# EAGLE design MaTouch Devkit_AC Dimmer V1.2 (EAGLE 6.1)
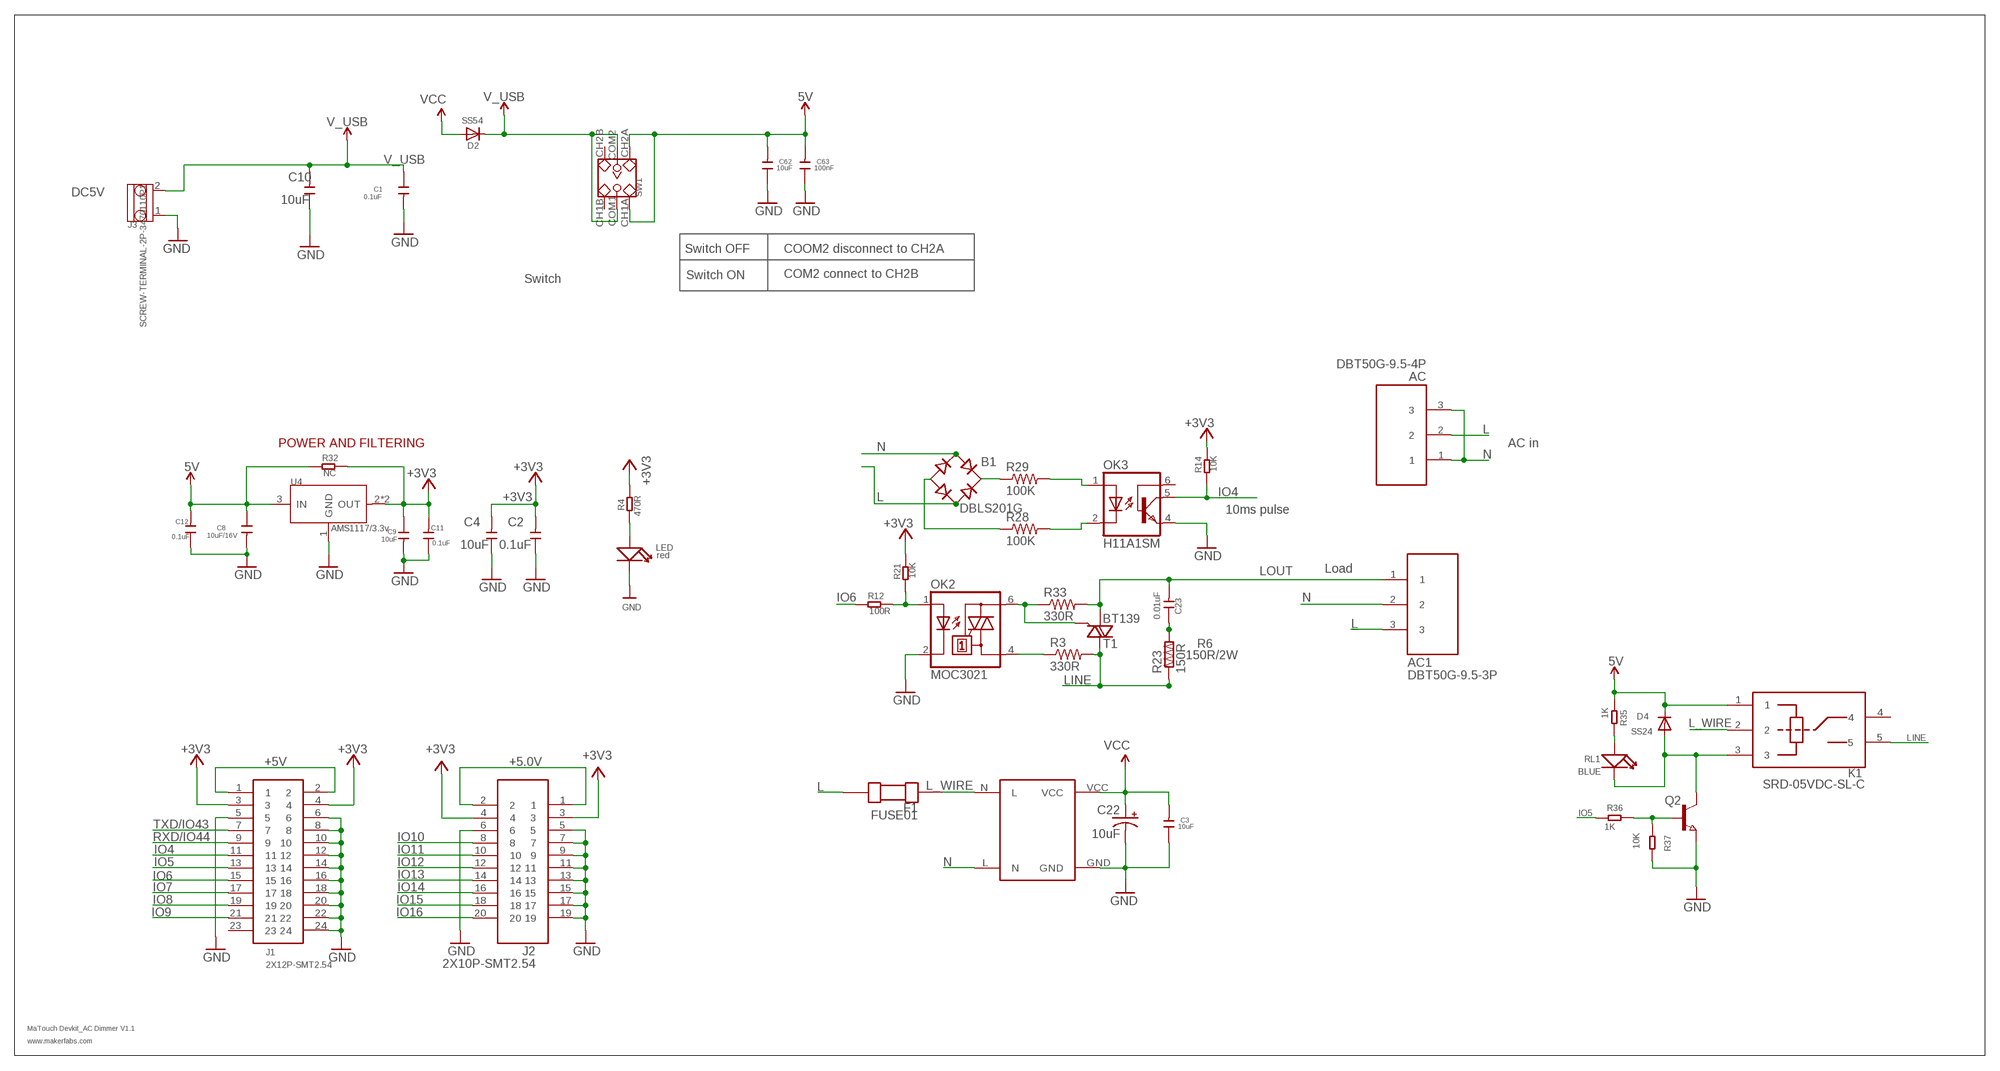
[diagram p0: schematic, sheet 1]

## Parts
AC  DBT50G-9.5-4P  DBT50G-9.5-3P  [THROUGH-HOLE-9.5]
AC1  DBT50G-9.5-3P  [THROUGH-HOLE-9.5]
B1  DBLS201G  [DBS]
C1  0.1uF  C-0603  [0603]
C2  0.1uF  C-0603  [0603]
C3  10uF  C-0603  [0603]
C4  10uF  C-0603  [0603]
C8  10uF/16V  C-0603  [0603]
C9  10uF  C-0603  [0603]
C10  10uF  C-0603  [0603]
C11  0.1uF  C-0603  [0603]
C12  0.1uF  C-0603  [0603]
C22  10uF  CAP_POL3528-KIT  [EIA3528-KIT]
C23  0.01uF  DISCRETE_C-0512  [DISCRETE_C0512/10.18]
C62  10uF  C-0603  [0603]
C63  100nF  C-0603  [0603]
D2  SS54  DIODESMA  [SMADIODE]
D4  SS24  DIODESMA  [SMADIODE]
F1  FUSE01  [FUSE01]
J1  2X12P-SMT2.54  [2X12P-SMT2.54]
J2  2X10P-SMT2.54  [2X10P-SMT2.54]
J3  SCREW-TERMINAL-2P-3470110P1  [2P-5.0]
K1  JQC3FF  [DIP5_JQC3FF]
LED  red  DISCRETE_LED0603  [DISCRETE_LED-0603]
OK2  MOC3021  MOC3031S  [DIL6-SMD]
OK3  H11A1SM  [DIL6-SMD]
Q2  NPN-TRANSISTOR_SOT23  [SOT23]
R3  330R  RESISTOR1206  [1206]
R4  470R  R-0603  [R0603]
R6  150R/2W  R-0617  [R-0617]
R12  100R  R-0603  [R0603]
R14  10K  R-0603  [R0603]
R21  10K  R-0603  [R0603]
R23  150R  R-US_V234/12  [V234/12]
R28  100K  RESISTOR1206  [1206]
R29  100K  RESISTOR1206  [1206]
R32  NC  R-0603  [R0603]
R33  330R  RESISTOR1206  [1206]
R35  1K  R-0603  [R0603]
R36  1K  R-0603  [R0603]
R37  10K  R-0603  [R0603]
RL1  BLUE  LED'0603'  [LED-0603]
SW1  SWITCH-2CH-6P'90D'  [6P-2CH-2.54-9.0X3.6-90D]
T1  BT139  BT136  [TO220AB]
U4  AMS1117/3.3v  LD1117'SOT89'  [SOT89]
U5  AC-DCHLK01  [HLK-PM01]

## Nets
5V: C8.1 C12.2 C62.2 C63.2 D4.C K1.1 R32.1 R35.1 SW1.CH1A SW1.CH2A U4.3(IN)
+3V3: C2.2 C4.2 C9.1 C11.2 J1.3 J1.4 J2.3 J2.4 R4.2 R14.2 R21.2 R32.2 U4.2(OUT) U4.4(OUT)
+5.0V: J2.1 J2.2
+5V: J1.1 J1.2
GND: C1.2 C2.1 C3.1 C4.1 C8.2 C9.2 C10.1 C11.1 C12.1 C22.C(-) C62.1 C63.1 J1.5 J1.6 J1.8 J1.10 J1.12 J1.14 J1.16 J1.18 J1.20 J1.22 J1.24 J2.5 J2.6 J2.7 J2.9 J2.11 J2.13 J2.15 J2.17 J2.19 J3.1 LED.- OK2.2(C) OK3.4(EMI) Q2.2(E) R37.2 U4.1(GND) U5.GND
IO4: J1.11 OK3.5(COL) R14.1
IO5: J1.13 R36.1
IO6: J1.15 R12.1
IO7: J1.17
IO8: J1.19
IO9: J1.21
IO10: J2.8
IO11: J2.10
IO12: J2.12
IO13: J2.14
IO14: J2.16
IO15: J2.18
IO16: J2.20
L: AC1.3 AC.2 B1.AC2 F1.P$2
L_WIRE: F1.P$1 K1.2 U5.N(L)
LINE: K1.5 R3.2 R6.1 R23.1 T1.2(A2)
LOUT: AC1.1 C23.P$2 R33.2 T1.1(A1)
N: AC1.2 AC.1 AC.3 B1.AC1 U5.L(N)
N$2: C23.P$1 R6.2 R23.2
N$3: LED.+ R4.1
N$14: OK2.1(A) R12.2 R21.1
N$15: B1.- R28.1
N$16: OK2.4(A1) R3.1
N$17: B1.+ R29.1
N$18: OK3.1(A) R29.2
N$19: OK3.2(C) R28.2
N$21: OK2.6(A2) R33.1 T1.3(G)
N$26: R35.2 RL1.+
N$27: D4.A K1.3 Q2.3(C) RL1.-
N$28: Q2.1(B) R36.2 R37.1
RXD/IO44: J1.9
TXD/IO43: J1.7
V_USB: C1.1 C10.2 D2.C J3.2 SW1.COM1 SW1.COM2
VCC: C3.2 C22.A(+) D2.A U5.VCC
Unconnected: J1.23 K1.4 OK3.6(BAS) SW1.CH1B SW1.CH2B

## Notes on the sheet
- DC5V
- Switch OFF | COOM2 disconnect to CH2A
- Switch ON | COM2 connect to CH2B
- Switch
- POWER AND FILTERING | AC in
- 10ms pulse
- Load
- SRD-05VDC-SL-C
- MaTouch Devkit_AC Dimmer V1.1
- www.makerfabs.com

## Library data of the parts
AC AC1 = self:DBT50G-9.5-3P
B1 = rectifier:DB?*G: Single Phase 1.0 AMP Glass Passivated Bridge Rectifier Taiwan Semiconductor Co.,Ltd. - TSC Source: http://www.taiwansemi.com/TSCbig5/ezcatfiles/cust/img/img/db101g.pdf http://www.ts.com.tw/db/pictures/modules/PDT/PDT060207001/DBLS201G.pdf
C1-C4 C8-C12 C62 C63 = Discrete:C*: Ceramic Capacitors
C22 = SparkFun-Capacitors:CAP_POL: Capacitor Polarized These are standard SMD and PTH capacitors. Normally 10uF, 47uF, and 100uF in electrolytic and tantalum varieties. Always verify the external diameter of the through hole cap, it varies with capacity, voltage, and manufacturer. The EIA devices should be standard.
C23 = A9G:DISCRETE_C*: Ceramic Capacitors
D2 D4 = adafruit:DIODE: Diode SMADIODE - SMA Surface Mount Package 20V 1A Schottky Diode Digikey: 641-1014-6-ND DO-1N4148 - Through Hole Small Current Diode SOD-123 20V 1 A (.5mV Vf) Schottky Diode - Digikey: MBRX120TPMSCT-ND SOD-323 10V 570mA (.38mV Vf, 3ns) Schottky Diode - Digikey: ZLLS410CT-ND SOD-523 30V 30mA Schottky Diode (RB751S-40TE61) - Digikey: RB751S-40TE61CT-ND SOT23-R/W - SOT23 Package (R = Solder Paste/Reflow Ovens, W = Hand-Soldering) BAT54Film 40V 300mA - Digikey: 497-7162-1-ND
F1 = FUSE01:FUSE01: FUSE
J1 = sale:2X12P-SMT2.54
J2 = sale:2X10P-SMT2.54
J3 = OPL Eagle Library:SCREW-TERMINAL-2P
K1 = 1mytest:JQC3FF
LED = A9G:DISCRETE_LED*
OK2 = optocoupler:MOC30*: 6-Pin DIP Zero-Cross Optoisolators Triac Driver Output (250/400 Volt Peak) Source: Data sheet <http://www.fairchildsemi.com/ds/MO/MOC3031M.pdf> The old path of data sheet not more available 2013-05-06.; MF: FAIRCHILD SEMICONDUCTOR; MPN: MOC3031SM; OC_FARNELL: unknown; OC_NEWARK: 34C1335
OK3 = optocoupler:H11A*?M: General Purpose 6-Pin Phototransistor Optocouplers Source: http://www.fairchildsemi.com/ds/4N/4N35-M.pdf; OC_FARNELL: unknown; OC_NEWARK: unknown
Q2 = semicon-smd-ipc:NPN-TRANSISTOR_: NPN TRANSISTOR
R3 R28 R29 R33 = SparkFun-Resistors:RESISTOR: Resistor Basic schematic elements and footprints for 0603, 1206, and PTH resistors.; K: 45K
R4 R12 R14 R21 R32 R35-R37 = Discrete:R*
R6 = Makerfabs-Peter:R-0617
R23 = adafruit2:R-US_: RESISTOR, American symbol
RL1 = Discrete:LED*
SW1 = Discrete:SWITCH-2CH-6P
T1 = triac:BT136: Triac BT136 series E sensitive gate Source: http://www.nxp.com/acrobat_download/datasheets/BT136_SERIES_E_2.pdf
U4 = IC:LD1117: Low Drop Fixed And Adjustable Positive Voltage Regulators http://www.datasheetcatalog.org/datasheet/SGSThomsonMicroelectronics/mXuqtqv.pdf
U5 = Moja Knjižnica:AC-DCHLK01

## Net classes
0 default: width 0.203 mm

## Board
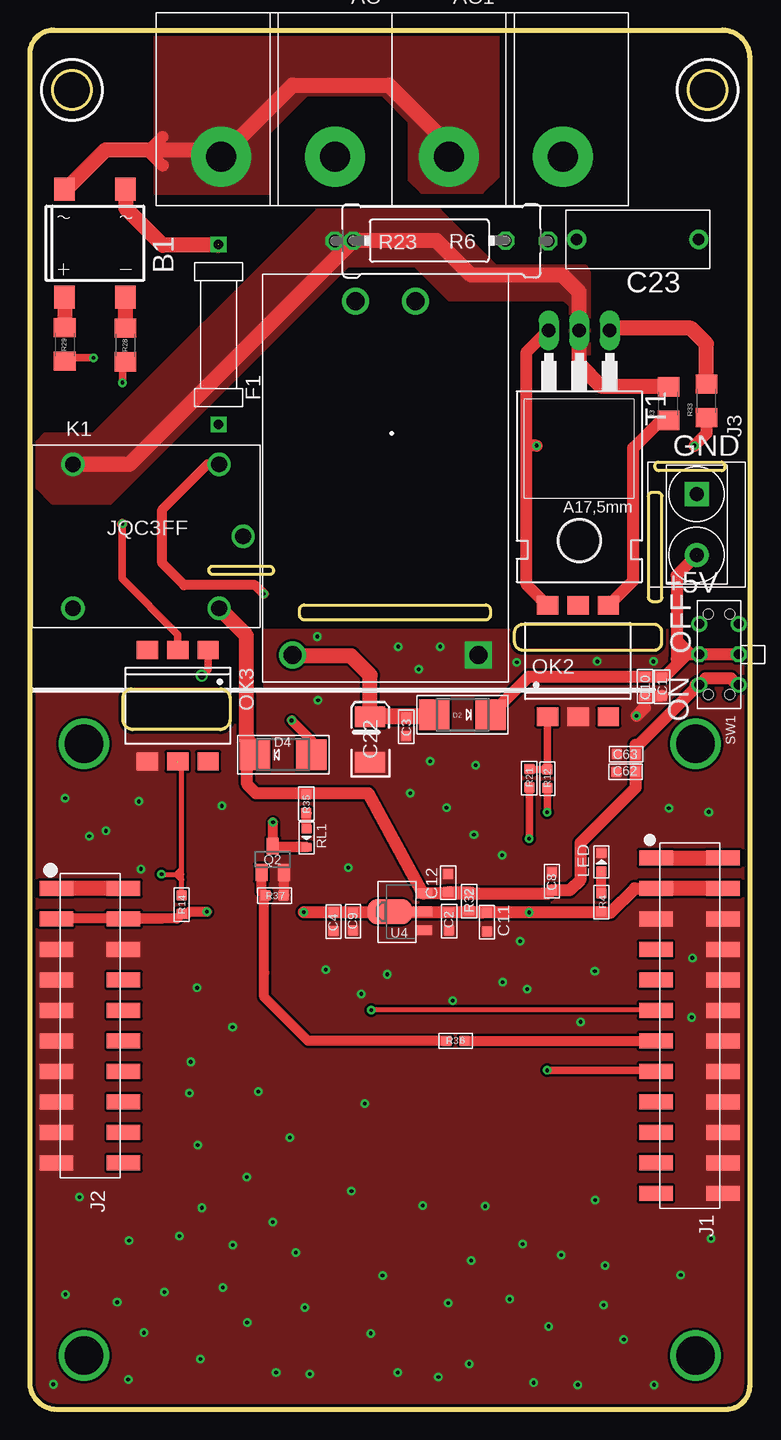
[diagram p1: board, top side]
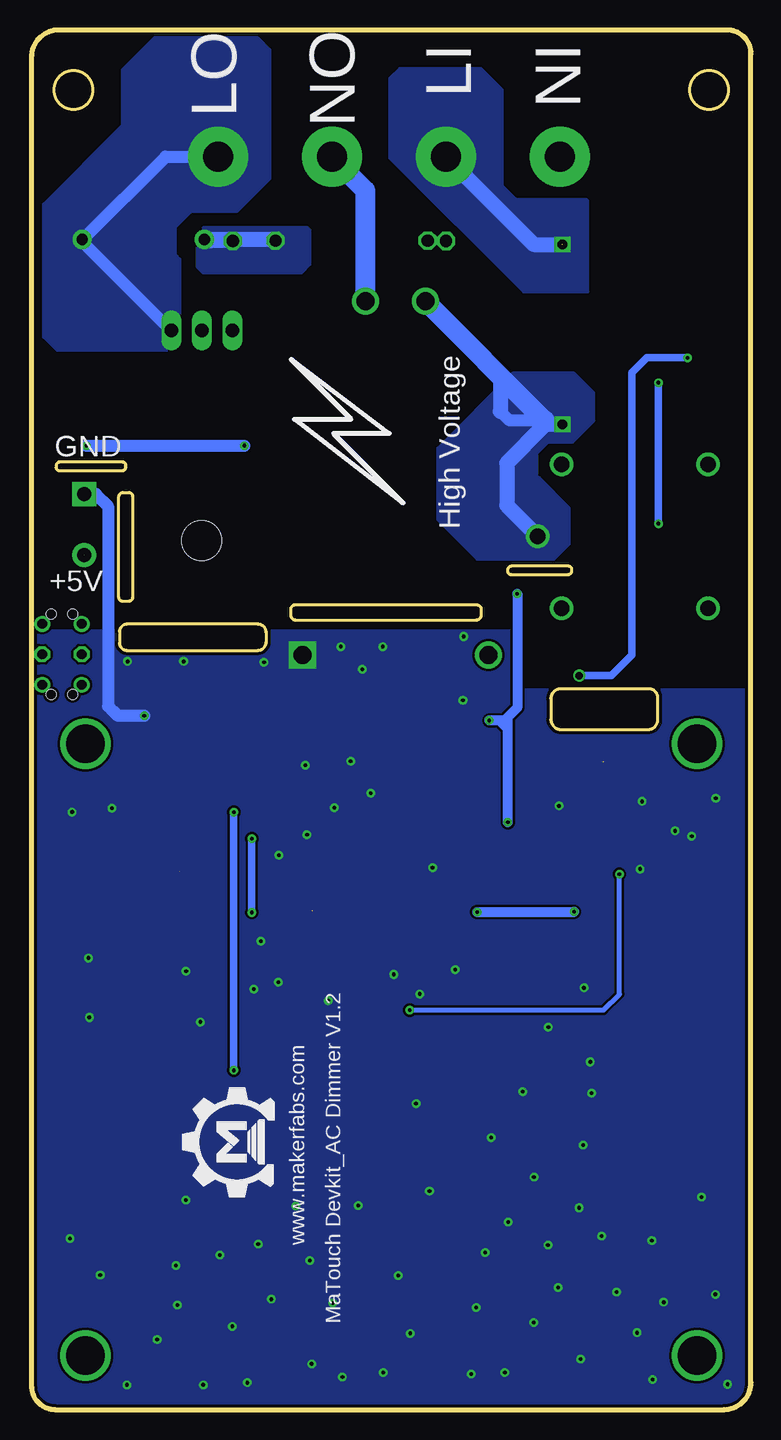
[diagram p2: board, bottom side, seen from below]

Size 60 x 115 mm. Coordinates in mm from the lower left corner, seen from the top.
Outline: 60,112.73 60,1.97 arc-90 58.03,0 2.24,0 arc-90 0,2.24 0,113.01 arc-90 1.99,115 57.73,115 arc-90 60,112.73
Outline: 52.65,64.84 52.65,63.9 arc-90 52.03,63.28 41.14,63.28 arc-90 40.41,64.01 40.41,64.75 arc-90 41.13,65.47 52.02,65.47 arc-90 52.65,64.84
Outline: 16.69,59.25 16.69,57.54 arc-90 15.82,56.68 8.6,56.68 arc-90 7.77,57.5 7.77,59.34 arc-90 8.51,60.08 15.86,60.08 arc-90 16.69,59.25
Outline: 38,65.82 22.9,65.82 arc-90 22.48,66.24 22.48,66.68 arc-90 22.87,67.07 38.01,67.07 arc-90 38.38,66.7 38.38,66.2 arc-90 38,65.82
Outline: 57.68,78.27 52.44,78.27 arc-90 52.12,78.59 52.12,78.71 arc-90 52.39,78.98 57.65,78.98 arc-90 57.94,78.69 57.94,78.53 arc-90 57.68,78.27
Outline: 52.37,76.44 51.87,76.44 arc90 51.56,76.13 51.56,67.71 arc90 51.9,67.37 52.38,67.37 arc90 52.7,67.69 52.7,76.11 arc90 52.37,76.44
Outline: 20,69.61 15.24,69.61 arc-90 14.94,69.92 14.94,70.04 arc-90 15.19,70.29 19.99,70.29 arc-90 20.3,69.99 20.3,69.9 arc-90 20,69.61
Outline: circle at 3.5,110 radius 1.6
Outline: circle at 56.5,110 radius 1.6
Copper layers (1*16): Top 0.035mm / dielectric 1.5mm / Bottom 0.035mm
Design rules: minimum track width 10mil, minimum drill 10mil, track to track 8mil, track to pad 8mil, pad to pad 8mil, via to via 8mil, smd to smd 0mil, copper to edge 10mil, drill to drill 8mil, minimum pad ring 10mil, minimum via ring 8mil, stop-mask expansion 4mil, vias tented up to drill 30mil, thermal gap 0mil

### Footprints (pad centres in the part's own frame; a part is rotated, then mirrored left to right if it is on the bottom)
THROUGH-HOLE-9.5 = drill 2.5 pad 5: 1 -9.5,0; 2 0,0; 3 9.5,0
DBS = smd 1.7 x 1.9: + -2.55,-4.5; - 2.55,-4.5; AC1 -2.55,4.5; AC2 2.55,4.5
0603 = smd 0.889 x 0.889: 1 -0.762,0; 2 0.762,0
EIA3528-KIT = smd 1.7 x 2.5: A 1.9,0; C -1.9,0
DISCRETE_C0512/10.18 = drill 0.95 pad 1.6: P$1 -5.09,0; P$2 5.09,0
SMADIODE = smd 2.54 x 2.54: A 2.349,0; C -2.349,0
FUSE01 = drill 0.8 square: P$1 -7.5,0; P$2 7.5,0
2X12P-SMT2.54 = smd 1.27 x 2.8: 1 -13.97,-2.8; 2 -13.97,2.8; 3 -11.43,-2.8; 4 -11.43,2.8; 5 -8.89,-2.8; 6 -8.89,2.8; 7 -6.35,-2.8; 8 -6.35,2.8; 9 -3.81,-2.8; 10 -3.81,2.8; 11 -1.27,-2.8; 12 -1.27,2.8; 13 1.27,-2.8; 14 1.27,2.8; 15 3.81,-2.8; 16 3.81,2.8; 17 6.35,-2.8; 18 6.35,2.8; 19 8.89,-2.8; 20 8.89,2.8; 21 11.43,-2.8; 22 11.43,2.8; 23 13.97,-2.8; 24 13.97,2.8
2X10P-SMT2.54 = smd 1.27 x 2.8: 1 -11.43,-2.8; 2 -11.43,2.8; 3 -8.89,-2.8; 4 -8.89,2.8; 5 -6.35,-2.8; 6 -6.35,2.8; 7 -3.81,-2.8; 8 -3.81,2.8; 9 -1.27,-2.8; 10 -1.27,2.8; 11 1.27,-2.8; 12 1.27,2.8; 13 3.81,-2.8; 14 3.81,2.8; 15 6.35,-2.8; 16 6.35,2.8; 17 8.89,-2.8; 18 8.89,2.8; 19 11.43,-2.8; 20 11.43,2.8
2P-5.0 = drill 1.168 pad 2.032 square: 1 -2.54,0 | drill 1.168 pad 2.032: 2 2.54,0
DIP5_JQC3FF = drill 1.3: 1 0,12; 2 -2,6; 3 0,0; 4 12.2,12; 5 12.2,0
DISCRETE_LED-0603 = smd 0.889 x 0.889: + -0.762,0; - 0.762,0
DIL6-SMD = smd 1.78 x 1.52: 1 -2.54,-4.645; 2 0,-4.645; 3 2.54,-4.645; 4 2.54,4.645; 5 0,4.645; 6 -2.54,4.645
SOT23 = smd 1 x 1.4: 1 -0.95,-1.1; 2 0.95,-1.1; 3 0,1.1
1206 = smd 1.6 x 1.8: 1 -1.4,0; 2 1.4,0
R0603 = smd 0.889 x 0.889: 1 -0.762,0; 2 0.762,0
R-0617 = drill 1.016 octagon: 1 -8.89,0; 2 8.89,0
V234/12 = drill 1.016 octagon: 1 -6.35,0; 2 6.35,0
LED-0603 = smd 0.762 x 0.889: + -0.762,0; - 0.762,0
6P-2CH-2.54-9.0X3.6-90D = drill 0.813 pad 1.27: CH1A -2.54,-1.65; CH1B 2.54,-1.65; CH2A -2.54,1.65; CH2B 2.54,1.65 | drill 0.813 pad 1.27 octagon: COM1 0,-1.65; COM2 0,1.65 | hole 0.813: -3.35,0.9; -3.35,-0.9; 3.35,0.9; 3.35,-0.9
TO220AB = drill 1.118 long: 1 -2.54,-6.35; 2 0,-6.35; 3 2.54,-6.35 | hole 3.302: 0,11.176
SOT89 = smd 0.8 x 1.4: 1 -1.524,-1.905; 3 1.524,-1.905 | smd 0.8 x 1.9: 2 0,-1.651 | smd 2.032 x 3.65: 4 0,0.94
HLK-PM01 = drill 1.5 square: GND 14.75,7.75 | drill 1.5: L -14.75,2.5; N -14.75,-2.5; VCC 14.75,-7.75

### Placement (x,y rotation side)
AC  25.45,104.46 180 top
AC1  34.95,104.46 180 top
B1  5.41,97.22 0 top
C1  52.7,60.26 270 top
C2  34.95,40.72 90 top
C3  31.37,56.91 90 top
C4  25.32,40.67 90 top
C8  43.52,44.06 90 top
C9  26.93,40.7 270 top
C10  51.28,60.29 90 top
C11  38.1,40.63 90 top
C12  34.87,43.9 270 top
C22  28.37,55.87 90 top
C23  50.67,97.55 0 top
C62  49.67,53.16 0 top
C63  49.69,54.63 0 top
D2  36.07,57.92 180 top
D4  21.11,54.6 0 top
F1  15.72,89.62 90 top
J1  55,32 270 top
J2  5,32 270 top
J3  55.6,73.77 270 top
K1  15.77,78.8 180 top
LED  47.65,45.63 90 top
OK2  45.69,62.39 0 top
OK3  12.32,58.66 180 top
Q2  20.24,45.86 0 top
R3  53.24,83.86 90 top
R4  47.65,42.28 270 top
R6  34.32,97.42 0 top
R12  43.15,52.59 90 top
R14  12.65,42.07 270 top
R21  41.63,52.61 270 top
R23  33.3,97.45 0 top
R28  7.95,88.73 270 top
R29  2.9,88.78 270 top
R32  36.62,42.38 270 top
R33  56.41,84.09 90 top
R35  23.04,50.51 270 top
R36  35.48,30.74 180 top
R37  20.4,42.84 0 top
RL1  23.06,47.64 270 top
SW1  57.45,62.95 90 top
T1  45.8,83.6 180 top
U4  30.94,41.5 90 top
U5  29.64,77.63 270 top
U$2  [MAKERFABS_0.3]  39.79,18.18 90 bottom

### Tracks (layer width: path | path; a pad name or v marks a point on that pad's centre or on a via)
5V
  Top 0.406: U4.3 32.65,43.22 | R32.1
  Top 0.813: U4.3 32.86,43.02 32.87,43.01 33.45,43.01 33.48,43.04 | C62.2 50.44,54.62 C63.2 50.46,54.65 50.49,54.65 | R35.1 22.94,51.37
  Top 1.016: 55.73,60.41 SW1.CH2A 56.34,60.95 58.45,60.95 58.98,60.41 SW1.CH1A | 55.73,60.41 55.5,60.41 | 34.77,43.04 43.26,43.04 C8.1 45.01,43.3 45.92,44.21 45.92,47.26 50.49,51.83 50.49,54.65 50.49,55.41 50.72,55.41 55.73,60.41 | 32.65,43.22 28.23,51.37 22.94,51.37 18.85,51.37 18.11,52.11 18.11,54.42 18.58,54.42 D4.C | 34.77,43.04 C12.2 R32.1 | 34.77,43.04 32.66,43.04 32.61,43.09 32.77,43.09 U4.3
  Top 1.27: D4.C 18.76,55.12 18.06,55.81 18.06,64.52 K1.1
+3V3  (via drill 0.3)  (1 unrouted)
  Top 0.406: 25.3,41.45 C4.2 26.9,41.43 C9.1 | U4.4 U4.2 34.93,41.5 C2.2 36.48,41.48 R32.2 36.85,41.38
  Top 0.61: C9.1 | 29.96,41.46 U4.4 30.03,41.46 30.3,41.46 30.34,41.43 | C11.2 37.74,41.39 37.69,41.43 | R21.2 v41.63,47.59 | v41.63,41.44 36.73,41.44 36.6,41.57
  Top 0.813: v14.76,41.49 13.28,41.49 13.08,41.29 12.68,41.29 R14.2 12.27,40.93 11,40.93 | 11,40.93 2.06,40.93 2.1,40.89 J2.3 | J2.4 7.84,40.93 11,40.93 | R4.2 47.62,41.49 47.62,41.43
  Top 1.016: v22.84,41.46 C9.1 29.96,41.46 | 30.34,41.43 37.69,41.43 47.62,41.43 47.74,41.43 48.4,41.43 50.42,43.45 52.25,43.45 | 52.25,43.45 52.32,43.45 52.35,43.42 | J1.3 52.23,43.43 52.25,43.45
  Top 1.27: J1.4 J1.3
  Bottom 0.61: v41.63,47.59 v41.63,41.44
  Bottom 0.813: v22.84,41.46 14.78,41.46 v14.76,41.49
+5.0V
  Top 1.27: J2.2 J2.1
+5V
  Top 1.27: J1.1 J1.2
GND  (via drill 0.3)
  Top 0.813: R37.2 21.19,42.87 Q2.2
  Top 1.016: v50.6,57.82 51.28,58.51 C10.1 51.31,59.5 C1.2
  Bottom 1.016: v50.6,57.82 52.81,57.82 53.09,58.1 | 53.09,58.1 53.62,58.64 53.62,75.3 54.63,76.31 J3.1 | 53.09,58.1 53.09,58.15
  other vias: 9.07,50.69 8.19,2.49 7.27,8.94 16.9,31.88 2.97,9.6 16.08,10.16 4.11,17.7 12.46,14.45 1.94,2.1 22.15,13.08 14.21,4.22 36.64,3.81 30.67,3.07 45.68,2.06 42,2.23 28.41,6.35 56.78,14.25 43.24,6.93 49.52,5.84 52.03,2.06 31.71,51.38 22.92,8.51 36.79,12.42 8.27,14.07 20.26,15.62 53.28,50.14 55.18,32.69 55.23,37.64 24.66,36.66 26.81,18.21 39.99,9.19 34.86,8.89 47.84,8.71 54.27,11.2 32.75,16.99 37.96,16.94 35.24,34.09 27.93,25.5 16.93,13.71 29.78,36.27 18.1,19.38 13.3,26.39 39.41,35.63 45.91,32.31 13.98,22.05 47.13,17.45 6.34,48.23 19.04,26.49 40.88,39.04 41.47,35.05 4.94,47.8 16.01,50.32 37.02,47.93 9.49,6.4 9.26,45.06 56.6,49.81 34.73,50.16 14.34,16.81 44.28,12.88 26.56,45.16 29.4,11.17 13.93,35.15 23.34,2.97 20.52,3.07 11.2,9.78 47.95,11.99 18.11,7.26 34.06,2.72 27.63,34.64 41.1,13.79 39.38,46.2 2.93,50.95 21.65,22.66 37.17,53.69 13.4,28.98 47.1,36.55 33.39,54.05 30.7,63.6 51.98,62.36 47.31,62.36 40.6,62.3 24.02,59.13 23.96,64.44 34.2,63.6 32.42,61.7
  pour Top: 63.02,-1.44 -2.08,-1.44 -2.08,60.08 19.58,60.08 19.58,64.98 63.02,64.98
  pour Bottom: 63.12,-1.54 -1.98,-1.54 -1.98,59.98 19.68,59.98 19.68,64.88 63.12,64.88
IO4  (via drill 0.3)  (1 unrouted)
  Top 0.406: J1.11 52.17,33.3 v28.45,33.3 | R14.1 12.65,44.16 | 12.65,44.16 12.65,44.64 | 12.65,44.64 12.65,53.66 12.32,53.99 | v10.97,44.61 12.19,44.61 | 12.19,44.61 12.62,44.61 12.65,44.64 | 12.6,45.02 12.19,44.61 | 12.19,44.61 12.65,44.16
  Bottom 0.406: v28.45,33.3 12.29,33.3 10.97,34.62 v10.97,44.61
IO5
  Top 0.813: R36.1 36.27,30.72 52.35,30.72 52.34,30.73 J1.13
IO6  (via drill 0.3)
  Top 0.61: v43.13,49.8 43.13,51.8 R12.1 | v43.13,28.27 52.15,28.27 52.25,28.18 J1.15
  Bottom 0.61: v43.13,28.27 v43.13,49.8
L  (1 unrouted)
  Top 1.27: 15.72,97.17 15.72,97.04 11.07,97.04 8,100.11 8,101.64 7.92,101.71 7.93,101.72 B1.AC2
  Bottom 1.27: AC.2 18.12,97.12 F1.P$2
  pour Bottom: 13.64,100.8 13.64,93.13 18.31,93.13 18.95,93.13 30.1,104.28 30.1,111.01 29.29,111.82 22.53,111.82 20.75,110.04 20.75,102.07 19.58,100.9 13.74,100.9
L_WIRE
  Bottom 1.016: 17.21,82.45 20.13,82.45 20.93,83.25
  Bottom 1.27: F1.P$1 16.88,82.12 17.21,82.45 17.21,82.04 20.37,78.88 20.37,75.37 17.78,72.78 K1.2 | 20.9,86.22 20.9,83.22
  Bottom 1.676: 17.21,82.45 U5.N
  pour Bottom: 17.86,77.71 17.7,77.71 15.16,75.17 15.16,72.12 16.43,70.85 22.81,70.85 26.11,74.15 26.11,80.15 19.84,86.42 14.78,86.42 13.16,84.8 13.16,82.36 14.91,80.61 16.94,80.61 17.88,79.67 17.88,77.74
LINE
  Top 1.27: R3.2 53.16,85.33 47.57,85.33 45.8,87.1 T1.2 45.8,93.15 44.4,94.55 44.32,94.55 44.3,94.58 36.78,94.58 33.91,97.45 R23.1 8.31,78.8 K1.5
  pour Top: 1.22,81.34 5.28,81.34 23.98,100.04 34.16,100.04 38.84,95.36 46.3,95.36 46.66,94.78 46.66,87.97 45.77,87.97 45.06,88.73 45.06,91.96 44.5,92.47 34.95,92.47 32.11,95.31 26.52,95.31 6.73,75.53 1.85,75.53 0.58,76.8 0.58,80.71
LOUT
  Top 1.27: R33.2 56.41,88.83 55.12,90.13 48.9,90.13 T1.1
  Bottom 1.016: 46.29,104.46 AC1.1 48.82,104.46 55.68,97.6 | T1.1 55.68,97.29 55.68,97.6 | 55.68,97.6 55.73,97.55 C23.P$2
  pour Bottom: 42.85,99.86 46.69,99.86 48.03,98.51 48.03,96.3 47.62,95.9 47.62,89.27 48.62,88.28 57.86,88.28 58.98,89.39 58.98,100.49 52.37,107.1 52.37,111.75 49.73,114.39 41.15,114.39 40.13,113.37 40.13,102.58
N
  Top 1.016: 11.02,106.08 9.86,104.91 11.07,103.69 11.1,103.69
  Top 1.27: AC.1 34.95,105.4 29.95,110.4 21.89,110.4 AC.3 15.42,104.99 6.27,104.99 2.95,101.66 2.9,101.66 2.87,101.69 B1.AC1 | B1.AC1 2.87,101.79 | B1.AC1
  Bottom 1.676: U5.L 32.14,101.62 35,104.48 34.98,104.48 AC.1
  pour Top: 10.41,101.38 19.91,101.38 19.91,106.36 23.14,109.59 29.34,109.59 31.62,107.3 31.62,102.47 32.64,101.46 37.74,101.46 39.07,102.78 39.07,114.97 10.41,114.97
N$1  (via drill 3.2)
  other vias: 4.5,4.5
N$2
  Bottom 1.27: C23.P$1 45.09,97.55 | 45.09,97.55 39.73,97.55 39.73,97.47 39.65,97.47 R23.2 | R6.2 45.09,97.42 45.09,97.55
  pour Bottom: 36.75,98.31 36.98,98.54 45.64,98.54 46.2,97.98 46.2,95.24 45.75,94.78 37.44,94.78 36.75,95.46
N$3  (1 unrouted)
  Top 0.813: R4.1 47.65,44.84 47.68,44.87
N$6A  (via drill 3.2)
  other vias: 55.5,4.5
N$7A  (via drill 3.2)
  other vias: 55.5,55.5
N$8A  (via drill 3.2)
  other vias: 4.5,55.5
N$14
  Top 0.61: OK2.1 R12.2 41.66,53.35 R21.1
N$15
  Top 1.27: R28.1 7.96,90.14 B1.-
N$16
  Top 1.016: OK2.4 50.29,69.1 50.29,80.15 52.6,82.46 R3.1
N$17
  Top 1.27: B1.+ 2.9,92.68 R29.1
N$18  (via drill 0.3, 0.6)
  Top 0.61: v5.28,87.67 3.25,87.67 3.07,87.49 3,87.49 R29.2 | v14.33,61.17 14.86,61.71 OK3.1
  Bottom 0.61: v5.28,87.67 8.69,87.67 9.93,86.42 9.93,62.88 11.63,61.17 v14.33,61.17
N$19  (via drill 0.3)
  Top 0.61: v7.72,85.6 7.72,87.11 | OK3.2 12.32,64.6 7.67,69.25 7.67,73.8
  Top 0.813: 7.67,73.8 v7.72,73.85
  Top 1.27: 7.72,87.11 R28.2
  Bottom 0.61: v7.72,73.85 v7.72,85.6
N$21  (via drill 0.3)
  Top 1.016: OK2.6 41.4,68.79 41.4,80.22 | 41.4,80.22 41.4,88.15 43.18,89.93 | R33.1 56.41,81.37 v55.4,80.35 | v42.24,80.35 41.53,80.35 41.4,80.22
  Top 1.27: T1.3 43.23,89.93 43.18,89.93
  Bottom 1.016: v55.4,80.35 v42.24,80.35
N$26
  Top 0.813: RL1.+ 23.06,49.72 R35.2
N$27  (via drill 0.3)
  Top 0.813: v21.82,57.44 23.46,55.8 D4.A 23.47,54.65 | v20.27,48.96 20.27,46.98 Q2.3 20.33,46.87 23.01,46.87 | RL1.- 23.01,46.87 | 23.01,46.87 22.99,46.9 20.32,46.9 20.3,46.92 20.27,46.92 | K1.3 14.81,78.8 11.02,75.02 11.02,70.55 12.85,68.72 18.77,68.72 v19.48,68.01
  Bottom 0.813: v19.48,68.01 19.48,58.51 20.36,57.63 | 20.36,57.63 20.55,57.44 20.78,57.44 | 20.78,57.44 20.85,57.44 | 20.85,57.44 20.98,57.44 | 20.98,57.44 v21.82,57.44 | 20.78,57.44 20.8,57.42 20.83,57.42 20.85,57.44 | 20.85,57.44 20.85,57.42 | v20.27,48.96 20.27,57.54 20.36,57.63 | 20.4,56.86 20.98,57.44
N$28
  Top 0.813: Q2.1 19.29,43.18 R37.1 19.53,42.73 19.53,36.44 19.53,34.38 23.17,30.74 R36.2
V_USB  (1 unrouted)
  Top 0.61: C1.1 52.45,61.02 52.4,61.07 51.31,61.07 C10.2
  Top 1.016: 54.76,62.95 SW1.COM2 SW1.COM1 | 54.76,62.95 52.88,61.07 52.4,61.07 41.57,61.07 D2.C | 54.76,62.95 54.28,62.95 53.92,62.6 53.92,69.56 J3.2 | 53.98,64.05 54.93,63.09 | 54.93,63.09 55.04,62.98 | 54.76,62.95 54.79,62.95 54.93,63.09
VCC
  Top 0.813: C3.2 29.23,57.67 29.13,57.77
  Top 1.016: 33.49,57.69 D2.A
  Top 1.27: 33.64,57.84 D2.A | D2.A 33.02,57.92 32.92,57.82 29.18,57.82 29.13,57.77 | U5.VCC 21.89,62.85 21.92,62.83 26.77,62.83 28.37,61.22 C22.A 33.56,57.77 D2.A

### Text on the board
tPlace: GND | +5V | OFF | ON
bPlace: NO | LO | NI | LI | GND | +5V | www.makerfabs.com | MaTouch Devkit_AC Dimmer V1.2
bNames: High Voltage